# EasyEDA schematic SCH_Proyecto1_2023-10-21.json
TITLE: Sheet_1; REV: 1.0; Date: 2023-09-23; Sheet: 1/1; Drawn By: a20201957; Company: Your Company
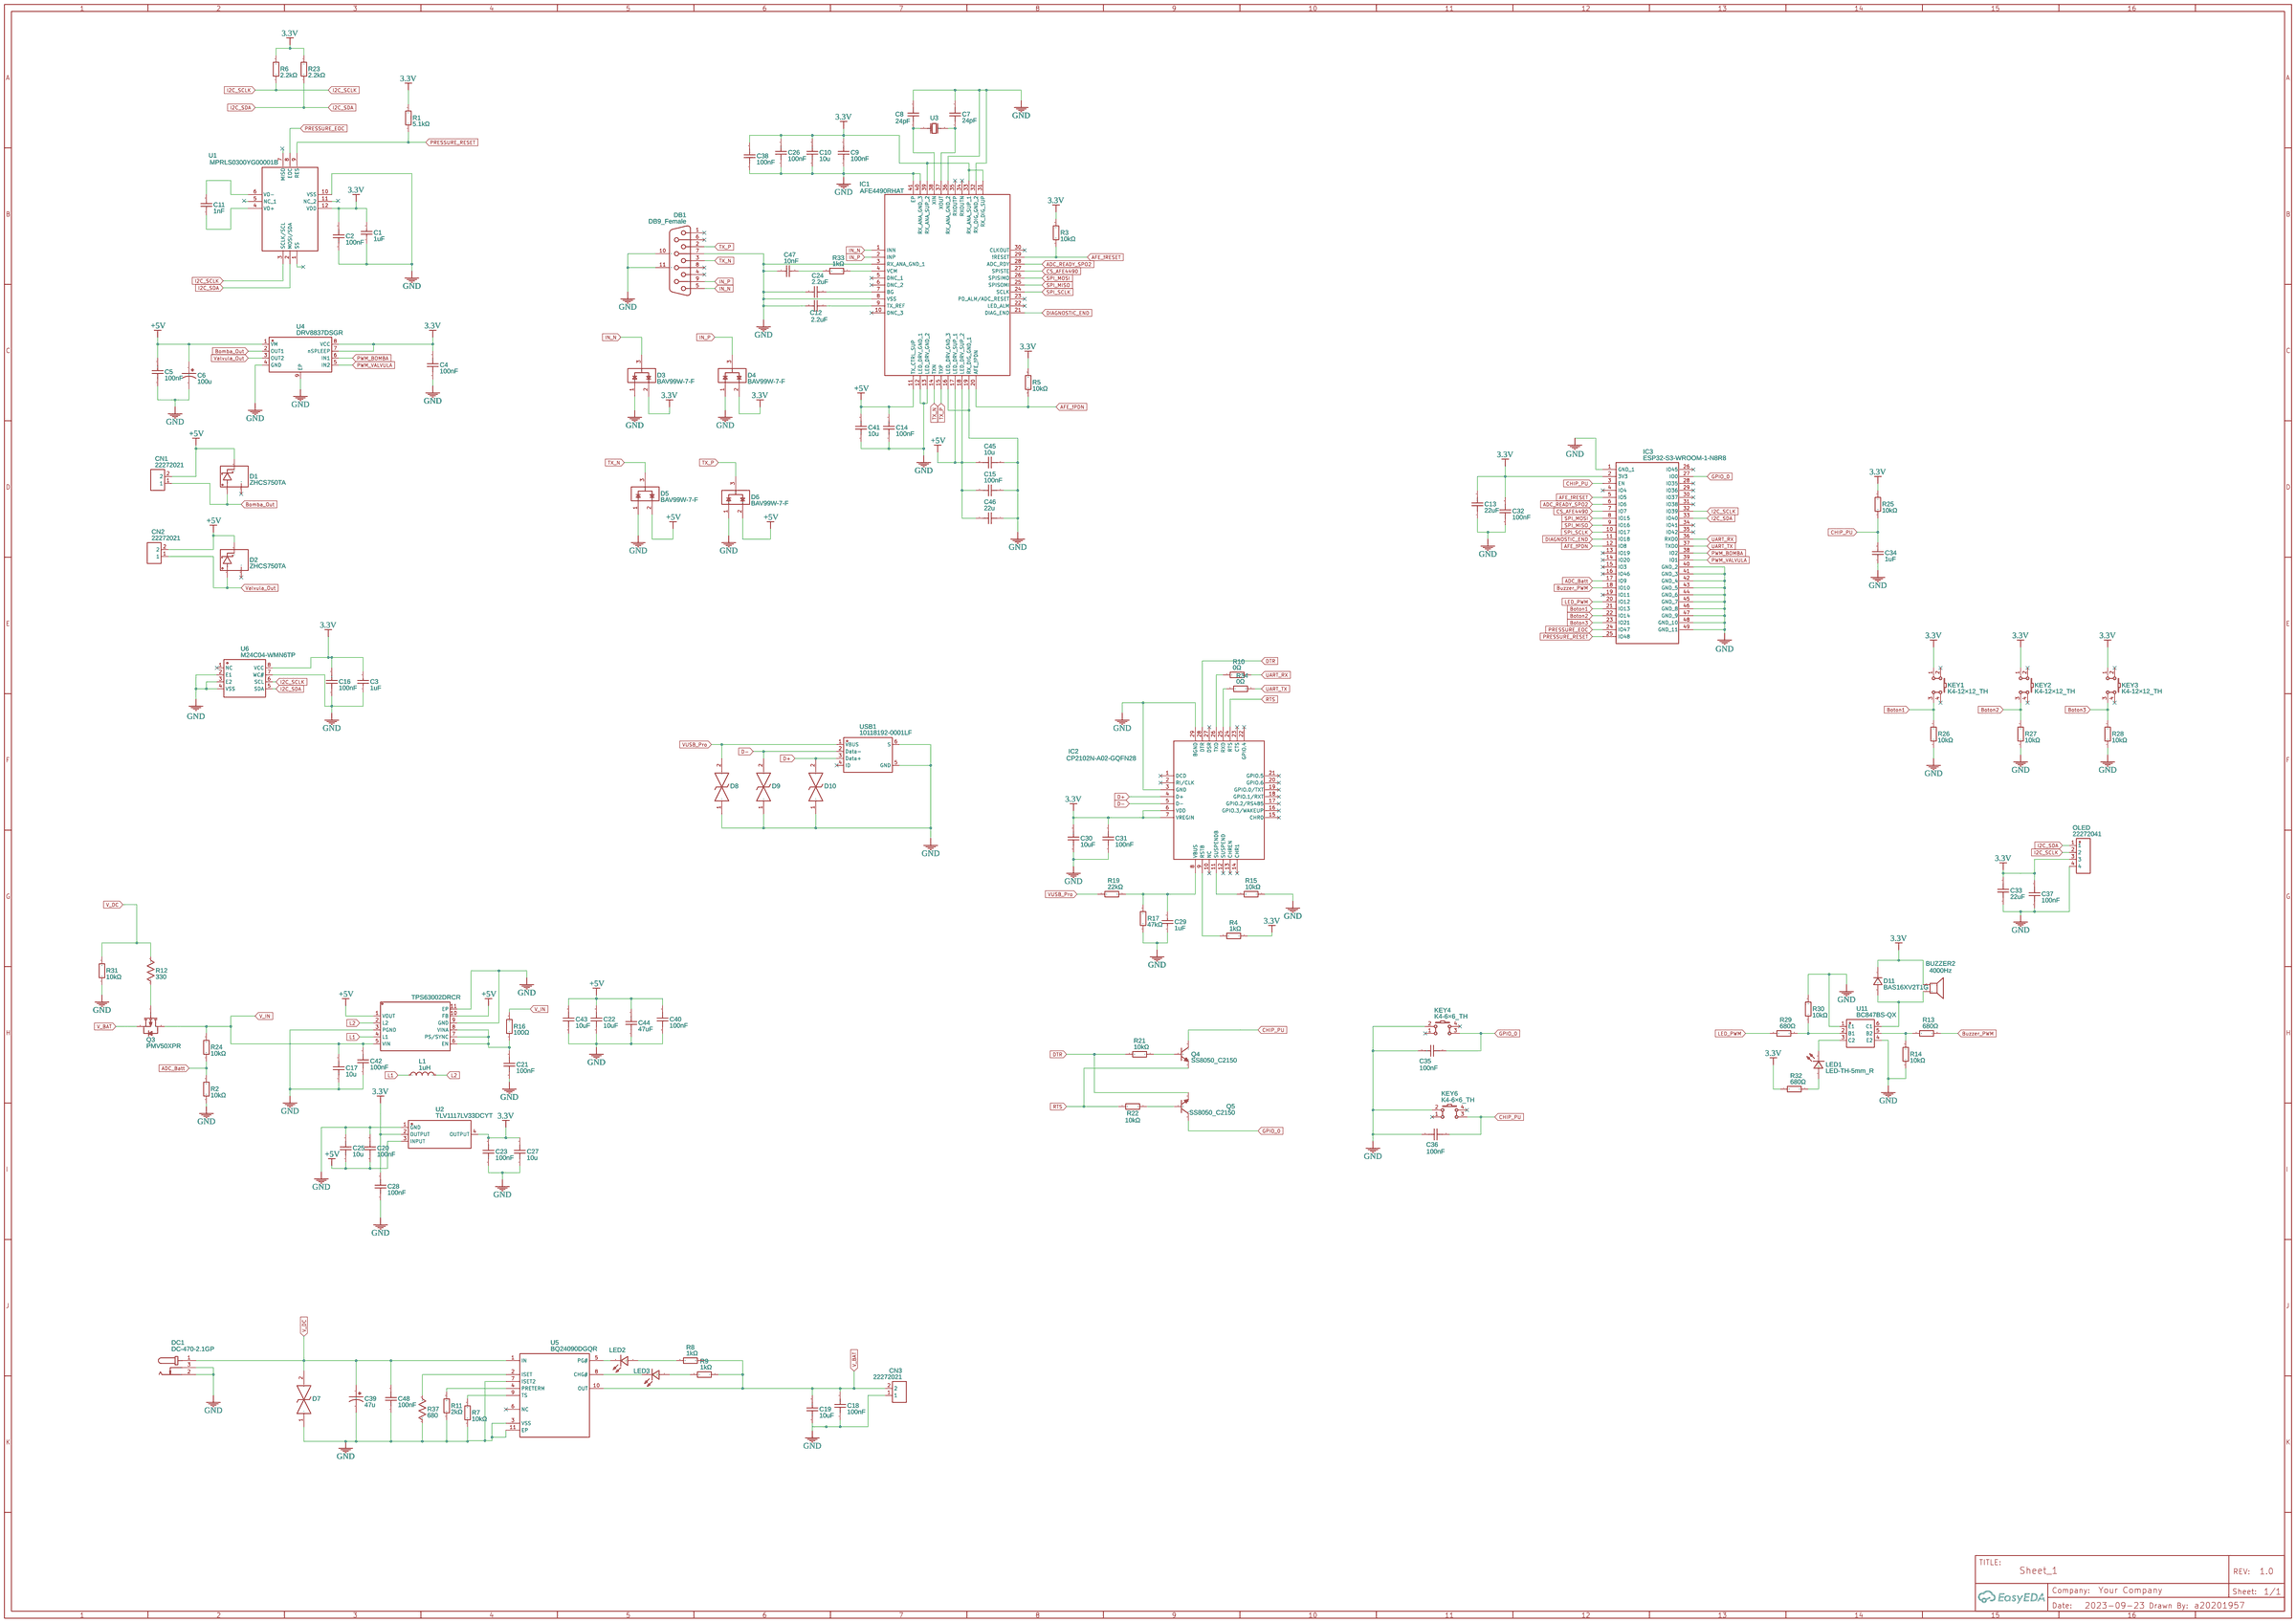
[diagram p0: schematic sheet]

## Parts
BUZZER2  4000Hz  [BUZ-TH_BD14.0-P7.60-D0.7-FD]
C1  1uF  [C0603]
C2  100nF  [C0603]
C3  1uF  [C0603]
C4  100nF  [C0603]
C5  100nF  [C0603]
C6  100u  [CAP-D5.0×F2.0]
C7  24pF  [C0603]
C8  24pF  [C0603]
C9  100nF  [C0603]
C10  10u  [C0805]
C11  1nF  [C0603]
C12  2.2uF  [C0603]
C13  22uF  [C0805]
C14  100nF  [C0603]
C15  100nF  [C0603]
C16  100nF  [C0603]
C17  10u  [C0805]
C18  100nF  [C0603]
C19  10uF  [C0805]
C20  100nF  [C0603]
C21  100nF  [C0603]
C22  10uF  [C0805]
C23  100nF  [C0603]
C24  2.2uF  [C0603]
C25  10u  [C0805]
C26  100nF  [C0603]
C27  10u  [C0805]
C28  100nF  [C0603]
C29  1uF  [C0603]
C30  10uF  [C0805]
C31  100nF  [C0603]
C32  100nF  [C0603]
C33  22uF  [C0805]
C34  1uF  [C0603]
C35  100nF  [C0603]
C36  100nF  [C0603]
C37  100nF  [C0603]
C38  100nF  [C0603]
C39  47u  [CAP-D5.0×F2.0]
C40  100nF  [C0603]
C41  10u  [C0805]
C42  100nF  [C0603]
C43  10uF  [C0805]
C44  47uF  [C1206]
C45  10u  [C0805]
C46  22u  [C0603]
C47  10nF  [C0603]
C48  100nF  [C0603]
CN1  22272021  [CONN-TH_22272021]
CN2  22272021  [CONN-TH_22272021]
CN3  22272021  [CONN-TH_22272021]
D1  ZHCS750TA  [SOT-23-3_L2.9-W1.6-P1.90-LS2.8-BR]
D2  ZHCS750TA  [SOT-23-3_L2.9-W1.6-P1.90-LS2.8-BR]
D3  BAV99W-7-F  [SOT-323_L2.0-W1.3-P1.30-LS2.1-BR]
D4  BAV99W-7-F  [SOT-323_L2.0-W1.3-P1.30-LS2.1-BR]
D5  BAV99W-7-F  [SOT-323_L2.0-W1.3-P1.30-LS2.1-BR]
D6  BAV99W-7-F  [SOT-323_L2.0-W1.3-P1.30-LS2.1-BR]
D7  CPDQ5V0-HF  [SODFL1006X40N]
D8  CPDQ5V0-HF  [SODFL1006X40N]
D9  CPDQ5V0-HF  [SODFL1006X40N]
D10  CPDQ5V0-HF  [SODFL1006X40N]
D11  BAS16XV2T1G  [SOD-523F_L1.2-W0.8-LS1.7-RD]
DB1  DB9_Female  [DSUB-TH_DMR-9S]
DC1  DC-470-2.1GP  [DC-IN-TH_DC-470-2.1GP]
IC1  AFE4490RHAT  [QFN50P600X600X100-41N]
IC2  CP2102N-A02-GQFN28  [QFN50P500X500X80-29N]
IC3  ESP32-S3-WROOM-1-N8R8  [ESP32S3WROOM1N8R8]
KEY1  K4-12×12_TH  [KEY-TH_4P-L12.0-W12.0-P5.00-LS12.5]
KEY2  K4-12×12_TH  [KEY-TH_4P-L12.0-W12.0-P5.00-LS12.5]
KEY3  K4-12×12_TH  [KEY-TH_4P-L12.0-W12.0-P5.00-LS12.5]
KEY4  K4-6×6_TH  [KEY-TH_4P-L6.0-W6.0-P4.50-LS6.5]
KEY6  K4-6×6_TH  [KEY-TH_4P-L6.0-W6.0-P4.50-LS6.5]
L1  1uH  [IND-SMD_L3.0-W3.0_NR3010]
LED1  LED-TH-5mm_R  [LED-TH_BD5.0_RED]
LED2  LED-TH-5mm_R  [LED-TH_BD5.0_RED]
LED3  LED-TH-5mm_G  [LED-TH_BD5.0_GREEN]
OLED  22272041  [CONN-TH_22272041]
Q3  PMV50XPR  [SOT-23-3_L2.9-W1.3-P1.90-LS2.4-BR]
Q4  SS8050_C2150  [SOT-23-3_L2.9-W1.3-P1.90-LS2.4-BR]
Q5  SS8050_C2150  [SOT-23-3_L2.9-W1.3-P1.90-LS2.4-BR]
R1  5.1kΩ  [R0603]
R2  10kΩ  [R0603]
R3  10kΩ  [R0603]
R4  1kΩ  [R0603]
R5  10kΩ  [R0603]
R6  2.2kΩ  [R0603]
R7  10kΩ  [R0603]
R8  1kΩ  [R0603]
R9  1kΩ  [R0603]
R10  0Ω  [R1206]
R11  2kΩ  [R0603]
R12  330  [R1206]
R13  680Ω  [R0603]
R14  10kΩ  [R0603]
R15  10kΩ  [R0603]
R16  100Ω  [R1206]
R17  47kΩ  [R0603]
R19  22kΩ  [R0603]
R21  10kΩ  [R0603]
R22  10kΩ  [R0603]
R23  2.2kΩ  [R0603]
R24  10kΩ  [R0603]
R25  10kΩ  [R0603]
R26  10kΩ  [R0603]
R27  10kΩ  [R0603]
R28  10kΩ  [R0603]
R29  680Ω  [R0603]
R30  10kΩ  [R0603]
R31  10kΩ  [R0603]
R32  680Ω  [R0603]
R33  1kΩ  [R0603]
R34  0Ω  [R1206]
R37  680  [R1206]
U1  MPRLS0300YG00001B  [MPRLS0300YG00001B]
U2  TLV1117LV33DCYT  [SOT-223-4_L6.5-W3.5-P2.30-LS7.0-BR]
U3  ECS-80-18-5PLX-AGN-TR  [OSC-SMD_2P-L11.4-W4.7-LS12.3]
U4  DRV8837DSGR  [WSON-8_L2.0-W2.0-P0.50-TL-EP]
U5  BQ24090DGQR  [MSOP-10_L3.0-W3.0-P0.50-LS5.0-BL-EP]
U6  M24C04-WMN6TP  [SOIC-8_L4.9-W3.9-P1.27-LS6.0-BL]
U7  TPS63002DRCR  [VSON-10_L3.0-W3.0-P0.50-BL-EP_TPS62410DRCR]
U11  BC847BS-QX  [SOT-363_L2.0-W1.3-P0.65-LS2.1-BR]
USB1  10118192-0001LF  [MICRO-USB-SMD_10118192-0001LF_1]

## Library data of the parts
BUZZER2 = SFN-1407PA7.6: Contributor: LCSC; Supplier: LCSC; Supplier Part: C360603; Manufacturer: S&S(海旭); JLCPCB Part Class: Extended Part; link: https://lcsc.com/eda_search?q=C360603&%26type=1&ref=editor
C1 C3 C29 C34 = CL10A105KB8NNNC: Supplier: LCSC; Manufacturer: SAMSUNG(三星); Supplier Part: C15849; JLCPCB Part Class: Basic Part; link: https://lcsc.com/eda_search?q=C15849&%26type=1&ref=editor
C2 C4 C5 C9 C14-C16 C18 C20 C21 C23 C26 C28 C31 C32 C35-C38 C40 C42 C48 = CC0603KRX7R9BB104: Supplier: LCSC; Manufacturer: YAGEO(国巨); Supplier Part: C14663; JLCPCB Part Class: Basic Part; link: https://lcsc.com/eda_search?q=C14663&%26type=1&ref=editor
C6 C39 = CE_TH_D5.0×F2.0_US: Contributor: LCEDA_Lib
C7 C8 C46 = C_0603_US: Contributor: LCEDA_Lib
C10 C17 C19 C22 C25 C27 C30 C41 C43 C45 = C_0805_US: Contributor: LCEDA_Lib
C11 = CL10B102KB8NNNC: Supplier: LCSC; Manufacturer: SAMSUNG(三星); Supplier Part: C1588; JLCPCB Part Class: Basic Part; link: https://lcsc.com/eda_search?q=C1588&%26type=1&ref=editor
C12 C24 = CL10A225KO8NNNC: Supplier: LCSC; Manufacturer: SAMSUNG(三星); Supplier Part: C23630; JLCPCB Part Class: Basic Part; link: https://lcsc.com/eda_search?q=C23630&%26type=1&ref=editor
C13 C33 = CL21A226MAQNNNE: Supplier: LCSC; Manufacturer: SAMSUNG(三星); Supplier Part: C45783; JLCPCB Part Class: Basic Part; link: https://lcsc.com/eda_search?q=C45783&%26type=1&ref=editor
C44 = CL31A476MPHNNNE: Supplier: LCSC; Manufacturer: SAMSUNG(三星); Supplier Part: C96123; JLCPCB Part Class: Basic Part; link: https://lcsc.com/eda_search?q=C96123&%26type=1&ref=editor
C47 = 0603B103K500NT: Supplier: LCSC; Manufacturer: FH(风华); Supplier Part: C57112; JLCPCB Part Class: Basic Part; link: https://lcsc.com/eda_search?q=C57112&%26type=1&ref=editor
CN1-CN3 = 22272021: Contributor: LCSC; Supplier: LCSC; Supplier Part: C293316; Manufacturer: MOLEX; JLCPCB Part Class: Extended Part; link: https://lcsc.com/eda_search?q=C293316&%26type=1&ref=editor
D1 D2 = ZHCS750TA: Contributor: LCSC; Supplier: LCSC; Supplier Part: C526777; Manufacturer: DIODES(美台); JLCPCB Part Class: Extended Part; link: https://lcsc.com/eda_search?q=C526777&%26type=1&ref=editor
D3-D6 = BAV99W-7-F: Contributor: LCSC; Supplier: LCSC; Manufacturer: DIODES(美台); Supplier Part: C93035; JLCPCB Part Class: Extended Part; link: https://lcsc.com/eda_search?q=C93035&%26type=1&ref=editor
D7-D10 = CPDQ5V0-HF: Contributor: a20201957
D11 = BAS16XV2T1G: Contributor: LCSC; Supplier: LCSC; Supplier Part: C152479; Manufacturer: onsemi(安森美); JLCPCB Part Class: Extended Part; link: https://lcsc.com/eda_search?q=C152479&%26type=1&ref=editor
DB1 = DB9_Female: Supplier Part: C141882; Supplier: LCSC; Manufacturer: Ckmtw(灿科盟); Contributor: LCEDA_Lib
DC1 = DC-470-2.1GP: Contributor: LCSC; Supplier: LCSC; Supplier Part: C194407; Manufacturer: GANGYUAN; JLCPCB Part Class: Extended Part; link: https://lcsc.com/eda_search?q=C194407&%26type=1&ref=editor
IC1 = AFE4490RHAT: Contributor: a20201957
IC2 = CP2102N-A02-GQFN28: Contributor: a20201957
IC3 = ESP32-S3-WROOM-1-N8R8: Contributor: a20201957
KEY1-KEY3 = K4-12×12_TH: Supplier Part: C128053; Supplier: LCSC; Manufacturer: 韩国韩荣; Manufacturer Part: K2-1103DP-M4SW-04; Contributor: LCEDA_Lib
KEY4 KEY6 = K4-6×6_TH: Supplier: LCSC; Supplier Part: C136684; Manufacturer: 韩国韩荣; Manufacturer Part: K2-1102DP-E4SW-04; Contributor: LCEDA_Lib
L1 = NR3015T1R0N: Contributor: LCSC; Supplier: LCSC; Supplier Part: C92931; Manufacturer: TAIYO YUDEN(太诱); JLCPCB Part Class: Extended Part; link: https://lcsc.com/eda_search?q=C92931&%26type=1&ref=editor
LED1 LED2 = LED-TH-5mm_R: Manufacturer: EVERLIGHT(台湾亿光); Manufacturer Part: 333-2SURD/S530-A3; Supplier Part: C87271; Supplier: LCSC; Contributor: LCEDA_Lib
LED3 = LED-TH-5mm_G: Manufacturer: EVERLIGHT(台湾亿光); Manufacturer Part: 333-2SYGD/S530-E2; Supplier Part: C88163; Supplier: LCSC; Contributor: LCEDA_Lib
OLED = 22272041: Contributor: LCSC; Supplier: LCSC; Supplier Part: C504991; Manufacturer: MOLEX; JLCPCB Part Class: Extended Part; link: https://lcsc.com/eda_search?q=C504991&%26type=1&ref=editor
Q3 = PMV50XPR: Contributor: LCSC; Supplier: LCSC; Supplier Part: C547261; Manufacturer: Nexperia(安世); JLCPCB Part Class: Extended Part; link: https://lcsc.com/eda_search?q=C547261&%26type=1&ref=editor
Q4 Q5 = SS8050_C2150: Supplier: LCSC; Manufacturer: CJ(江苏长电/长晶); Manufacturer Part: SS8050; Supplier Part: C2150; JLCPCB Part Class: Basic Part; link: https://lcsc.com/eda_search?q=C2150&%26type=1&ref=editor
R1 = 0603WAF5101T5E: Supplier: LCSC; Manufacturer: UNI-ROYAL(厚声); Supplier Part: C23186; JLCPCB Part Class: Basic Part; link: https://lcsc.com/eda_search?q=C23186&%26type=1&ref=editor
R2 R3 R5 R7 R14 R15 R21 R22 R24-R28 R30 R31 = 0603WAF1002T5E: Supplier: LCSC; Manufacturer: UNI-ROYAL(厚声); Supplier Part: C25804; JLCPCB Part Class: Basic Part; link: https://lcsc.com/eda_search?q=C25804&%26type=1&ref=editor
R4 R8 R9 R33 = 0603WAF1001T5E: Supplier: LCSC; Manufacturer: UNI-ROYAL(厚声); Supplier Part: C21190; JLCPCB Part Class: Basic Part; link: https://lcsc.com/eda_search?q=C21190&%26type=1&ref=editor
R6 R23 = 0603WAF2201T5E: Supplier: LCSC; Manufacturer: UNI-ROYAL(厚声); Supplier Part: C4190; JLCPCB Part Class: Basic Part; link: https://lcsc.com/eda_search?q=C4190&%26type=1&ref=editor
R10 R34 = 1206W4F0000T5E: Supplier: LCSC; Manufacturer: UNI-ROYAL(厚声); Supplier Part: C17888; JLCPCB Part Class: Basic Part; link: https://lcsc.com/eda_search?q=C17888&%26type=1&ref=editor
R11 = 0603WAF2001T5E: Supplier: LCSC; Manufacturer: UNI-ROYAL(厚声); Supplier Part: C22975; JLCPCB Part Class: Basic Part; link: https://lcsc.com/eda_search?q=C22975&%26type=1&ref=editor
R12 R37 = R_1206_US: Contributor: LCEDA_Lib
R13 R29 R32 = 0603WAF6800T5E: Supplier: LCSC; Manufacturer: UNI-ROYAL(厚声); Supplier Part: C23228; JLCPCB Part Class: Basic Part; link: https://lcsc.com/eda_search?q=C23228&%26type=1&ref=editor
R16 = 1206W4F1000T5E: Supplier: LCSC; Manufacturer: UNI-ROYAL(厚声); Supplier Part: C17901; JLCPCB Part Class: Basic Part; link: https://lcsc.com/eda_search?q=C17901&%26type=1&ref=editor
R17 = 0603WAF4702T5E: Supplier: LCSC; Manufacturer: UNI-ROYAL(厚声); Supplier Part: C25819; JLCPCB Part Class: Basic Part; link: https://lcsc.com/eda_search?q=C25819&%26type=1&ref=editor
R19 = 0603WAF2202T5E: Supplier: LCSC; Manufacturer: UNI-ROYAL(厚声); Supplier Part: C31850; JLCPCB Part Class: Basic Part; link: https://lcsc.com/eda_search?q=C31850&%26type=1&ref=editor
U1 = MPRLS0300YG00001B: Contributor: BenjaminTPU
U2 = TLV1117LV33DCYT: Contributor: lcsc; Supplier: LCSC; Supplier Part: C2877977; Manufacturer: TI(德州仪器); JLCPCB Part Class: Extended Part; link: https://lcsc.com/eda_search?q=C2877977&%26type=1&ref=editor
U3 = ECS-80-18-5PLX-AGN-TR: Contributor: lcsc; Supplier: LCSC; Supplier Part: C2450483; Manufacturer: ECS; JLCPCB Part Class: Extended Part; link: https://lcsc.com/eda_search?q=C2450483&%26type=1&ref=editor
U4 = DRV8837DSGR: Supplier: LCSC; Manufacturer: TI(德州仪器); Supplier Part: C39159; JLCPCB Part Class: Extended Part; link: https://lcsc.com/eda_search?q=C39159&%26type=1&ref=editor
U5 = BQ24090DGQR: Supplier: LCSC; Manufacturer: TI(德州仪器); Supplier Part: C43306; JLCPCB Part Class: Extended Part; link: https://lcsc.com/eda_search?q=C43306&%26type=1&ref=editor
U6 = M24C04-WMN6TP: Supplier: LCSC; Manufacturer: ST(意法半导体); Supplier Part: C118280; JLCPCB Part Class: Extended Part; link: https://lcsc.com/eda_search?q=C118280&%26type=1&ref=editor
U7 = TPS63002DRCR: Contributor: LCSC; Supplier: LCSC; Supplier Part: C116655; Manufacturer: TI(德州仪器); JLCPCB Part Class: Extended Part; link: https://lcsc.com/eda_search?q=C116655&%26type=1&ref=editor
U11 = BC847BS-QX: Contributor: lcsc; Supplier: LCSC; Supplier Part: C5205161; Manufacturer: Nexperia(安世); link: https://lcsc.com/eda_search?q=C5205161&%26type=1&ref=editor
USB1 = 10118192-0001LF: Contributor: LCSC; Supplier: LCSC; Supplier Part: C132564; Manufacturer: Amphenol; JLCPCB Part Class: Extended Part; link: https://lcsc.com/eda_search?q=C132564&%26type=1&ref=editor

## Nets
3.3V: BUZZER2.1 C1.2 C2.2 C3.2 C4.2 C9.2 C10.2 C13.2 C16.2 C23.2 C26.2 C27.2 C28.2 C30.2 C31.2 C32.2 C33.2 C37.2 C38.2 D3.2 D4.2 D11.1(C) IC1.31(RX_DIG_SUP) IC1.33(RX_ANA_SUP_1) IC1.39(RX_ANA_SUP_2) IC2.6(VDD) IC2.7(VREGIN) IC3.2(3V3) KEY1.1 KEY2.1 KEY3.1 OLED.3 R1.2 R3.2 R4.1 R5.2 R6.2 R23.2 R25.2 R32.1 U1.12(VDD) U2.2(OUTPUT) U2.4(OUTPUT) U4.7(nSPLEEP) U4.8(VCC) U6.8(VCC)
+5V: C5.2 C6.1 C14.2 C15.2 C20.1 C22.2 C25.1 C40.2 C41.2 C43.2 C44.2 C45.2 C46.2 CN1.2 CN2.2 D1.3 D2.3 D5.2 D6.2 IC1.11(TX_CTRL_SUP) IC1.17(LED_DRV_SUP_1) IC1.18(LED_DRV_SUP_2) U2.3(INPUT) U4.1(VM) U7.1(VOUT) U7.10(FB)
GND: C1.1 C2.1 C3.1 C4.1 C5.1 C6.2 C7.2 C8.2 C9.1 C10.1 C12.1 C13.1 C14.1 C15.1 C16.1 C17.1 C18.1 C19.1 C20.2 C21.1 C22.1 C23.1 C24.1 C25.2 C26.1 C27.1 C28.1 C29.1 C30.1 C31.1 C32.1 C33.1 C34.1 C35.2 C36.2 C37.1 C38.1 C39.2 C40.1 C41.1 C42.1 C43.1 C44.1 C45.1 C46.1 C47.1 C48.1 CN3.1 D3.1 D4.1 D5.1 D6.1 D7.1 D8.1 D9.1 D10.1 DB1.7 DB1.10(MH1) DB1.11(MH2) DC1.2 DC1.3 IC1.3(RX_ANA_GND_1) IC1.8(VSS) IC1.12(LED_DRV_GND_1) IC1.13(LED_DRV_GND_2) IC1.16(LED_DRV_GND_3) IC1.19(RX_DIG_GND_1) IC1.32(RX_DIG_GND_2) IC1.36(RX_ANA_GND_2) IC1.40(RX_ANA_GND_3) IC1.41(EP) IC2.3(GND) IC2.29(BGND) IC3.1(GND) IC3.40(GND_2) IC3.41(GND_3) IC3.42(GND_4) IC3.43(GND_5) IC3.44(GND_6) IC3.45(GND_7) IC3.46(GND_8) IC3.47(GND_9) IC3.48(GND_10) IC3.49(GND_11) KEY4.2 KEY6.2 OLED.4 R2.1 R7.1 R11.1 R14.1 R15.1 R17.1 R26.1 R27.1 R28.1 R30.2 R31.1 R37.1 U1.10(VSS) U2.1(GND) U4.4(GND) U4.9(EP) U5.3(VSS) U5.7(ISET2) U5.11(EP) U6.2(E1) U6.3(E2) U6.4(VSS) U6.7(WC#) U7.3(PGND) U7.9(GND) U7.11(EP) U11.1(E1) U11.4(E2) USB1.5(GND) USB1.6(S)
ADC_Batt: IC3.17(IO9) R2.2 R24.1
ADC_READY_SPO2: IC1.28(ADC_RDY) IC3.6(IO6)
AFE_!PDN: IC1.20(AFE_!PDN) IC3.12(IO8) R5.1
AFE_!RESET: IC1.29(!RESET) IC3.5(IO5) R3.1
Bomba_Out: CN1.1 D1.1 U4.2(OUT1)
Boton1: IC3.21(IO13) KEY1.3 R26.2
Boton2: IC3.22(IO14) KEY2.3 R27.2
Boton3: IC3.23(IO21) KEY3.3 R28.2
Buzzer_PWM: IC3.18(IO10) R13.2
CHIP_PU: C34.2 C36.1 IC3.3(EN) KEY6.3 Q4.3(C) R25.1
CS_AFE4490: IC1.27(SPISTE) IC3.7(IO7)
D+: D10.2 IC2.4(D+) USB1.3(Data+)
D-: D9.2 IC2.5(D-) USB1.2(Data-)
DIAGNOSTIC_END: IC1.21(DIAG_END) IC3.11(IO18)
DTR: IC2.28(DTR) Q5.2(E) R21.2
GPIO_0: C35.1 IC3.27(IO0) KEY4.3 Q5.3(C)
I2C_SCLK: IC3.32(IO39) OLED.2 R6.1 U1.3(SCLK/SCL) U6.6(SCL)
I2C_SDA: IC3.33(IO40) OLED.1 R23.1 U1.2(MOSI/SDA) U6.5(SDA)
IN_N: D3.3 DB1.5 IC1.1(INN)
IN_P: D4.3 DB1.9 IC1.2(INP)
L1: L1.1 U7.4(L1)
L2: L1.2 U7.2(L2)
LED_PWM: IC3.20(IO12) R29.1
PRESSURE_EOC: IC3.24(IO47) U1.8(EOC)
PRESSURE_RESET: IC3.25(IO48) R1.1 U1.9(RES)
PWM_BOMBA: IC3.38(IO2) U4.6(IN1)
PWM_VALVULA: IC3.39(IO1) U4.5(IN2)
RTS: IC2.24(RTS) Q4.2(E) R22.2
SPI_MISO: IC1.25(SPISOMI) IC3.9(IO16)
SPI_MOSI: IC1.26(SPISIMO) IC3.8(IO15)
SPI_SCLK: IC1.24(SCLK) IC3.10(IO17)
TX_N: D5.3 DB1.3 IC1.14(TXN)
TX_P: D6.3 DB1.2 IC1.15(TXP)
UART_RX: IC3.36(RXD0) R10.2
UART_TX: IC3.37(TXD0) R34.2
V_BAT: C18.2 C19.2 CN3.2 Q3.2(S) R8.1 R9.1 U5.10(OUT)
V_DC: C39.1 C48.2 D7.2 DC1.1 R12.2 R31.2 U5.1(IN)
V_IN: C17.2 C42.2 Q3.3(D) R16.2 R24.2 U7.5(VIN)
Valvula_Out: CN2.1 D2.1 U4.3(OUT2)
VUSB_Pro: D8.2 R19.2 USB1.1(VBUS)
Net-(BUZZER2-2): BUZZER2.2 D11.2(A) U11.6(C1)
Net-(C7-1): C7.1 IC1.37(XOUT) U3.2(OSC2)
Net-(C8-1): C8.1 IC1.38(XIN) U3.1(OSC1)
Net-(C11-1): C11.1 U1.4(VO+)
Net-(C11-2): C11.2 U1.6(VO-)
Net-(C12-2): C12.2 IC1.9(TX_REF)
Net-(C21-2): C21.2 R16.1 U7.6(EN) U7.7(PS/SYNC) U7.8(VINA)
Net-(C24-2): C24.2 IC1.7(BG)
Net-(C29-2): C29.2 IC2.8(VBUS) R17.2 R19.1
Net-(C47-2): C47.2 R33.2
Net-(IC1-4): IC1.4(VCM) R33.1
Net-(IC2-9): IC2.9(RSTB) R4.2
Net-(IC2-11): IC2.11(SUSPENDB) R15.2
Net-(IC2-25): IC2.25(RXD) R34.1
Net-(IC2-26): IC2.26(TXD) R10.1
Net-(LED1-1): LED1.1 R32.2
Net-(LED1-2): LED1.2 U11.3(C2)
Net-(LED2-1): LED2.1 R8.2
Net-(LED2-2): LED2.2 U5.5(PG#)
Net-(LED3-1): LED3.1 R9.2
Net-(LED3-2): LED3.2 U5.8(CHG#)
Net-(Q3-1): Q3.1(G) R12.1
Net-(Q4-1): Q4.1(B) R21.1
Net-(Q5-1): Q5.1(B) R22.1
Net-(R7-2): R7.2 U5.9(TS)
Net-(R11-2): R11.2 U5.4(PRETERM)
Net-(R13-1): R13.1 R14.2 U11.5(B2)
Net-(R29-2): R29.2 R30.1 U11.2(B1)
Net-(R37-2): R37.2 U5.2(ISET)

Not connected (* = marked no-connect by the designer): D1 2*; D2 2*; DB1 1* 4* 6* 8*; IC1 5(DNC_1)* 6(DNC_2)* 10(DNC_3)* 22(LED_ALM)* 23(PD_ALM/ADC_RESET)* 30(CLKOUT)* 34(RXOUTN)* 35(RXOUTP)*; IC2 1(DCD)* 2(RI/CLK)* 10(NC)* 12(SUSPEND)* 13(CHREN)* 14(CHR1)* 15(CHR0)* 16(GPIO.3/WAKEUP)* 17(GPIO.2/RS485)* 18(GPIO.1/RXT)* 19(GPIO.0/TXT)* 20(GPIO.6)* 21(GPIO.5)* 22(GPIO.4)* 23(CTS)* 27(DSR)*; IC3 4(IO4)* 13(IO19)* 14(IO20)* 15(IO3)* 16(IO46)* 19(IO11)* 26(IO45)* 28(IO35)* 29(IO36)* 30(IO37)* 31(IO38)* 34(IO41)* 35(IO42)*; KEY1 2* 4*; KEY2 2* 4*; KEY3 2* 4*; KEY4 1* 4*; KEY6 1* 4*; U1 1(SS) 5(NC_1) 7(MISO) 11(NC_2); U5 6(NC)*; U6 1(NC)*; USB1 4(ID)*
